# Altium schematic sheet Li-Ion boost.SchDoc
size A
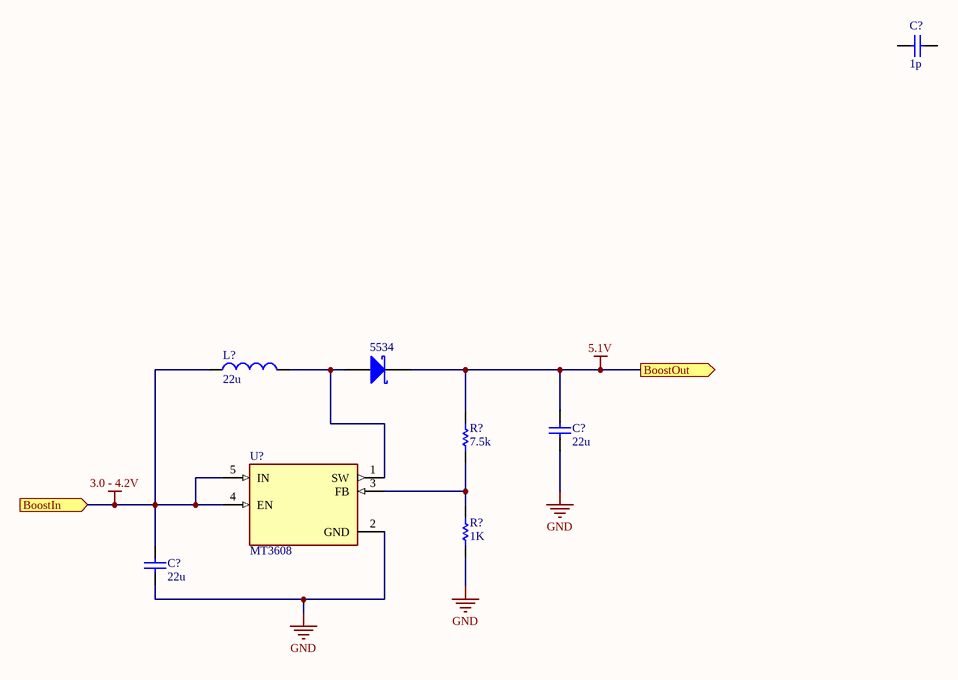
[diagram p0: Li-Ion boost.SchDoc]

## Parts
(Parts that share a designator on the sheet are numbered #1, #2 ... from top to bottom, then left to right.)
5534  Shottky Diode  (value not drawn)
C?#1  value 1p  (hidden comment: Capacitor)
C?#2  value 22u  (hidden comment: Capacitor)
C?#3  value 22u  (hidden comment: Capacitor)
L?  value 22u  (hidden comment: Inductor)
R?#1  value 7.5k  (hidden comment: Resistor)
R?#2  value 1K  (hidden comment: Resistor)
U?  MT3608  [SOT95P280X145-6N]

## Ports
BoostIn (in), BoostOut (out)

## Nets
3.0 - 4.2V: C?#3.2 L?.1 U?.4(EN) U?.5(IN) ; port BoostIn
5.1V: 5534.2(K) C?#2.2 R?#1.2 ; port BoostOut
GND: C?#2.1 C?#3.1 R?#2.1 U?.2(GND)
Net5534_1: 5534.1(A) L?.2 U?.1(SW)
NetR?#1_1: R?#1.1 R?#2.2 U?.3(FB)

Not connected (* = marked no-connect by the designer): C?#1 1 2

## Library data of the parts
5534 = Shottky Diode: AF: 1; BV: 0; BV_MAX: 1e99; EG: 1.11; FC: 0.5; IBV: 0.001; IS: 1e-14; MJSW: 0.33; NTUN: 30; TNOM: 27; XTI: 3; SimulationGenericComponent: True; CJO: 0; CJP: 0; CTA: 0; CTP: 0; FCS: 0.5; FV_MAX: 1e99; IKF: 0; IKR: 0; ISR: 1e-14; JSW: 0; JTUN: 0; JTUNSW: 0; KEG: 1; KF: 0; LEVEL: 1; N: 1; NBV: 1; NR: 1; NS: 1; PHP: 1; RS: 0; TCV: 0; TLEV: 0; TLEVC: 0; TM1: 0; TM2: 0; TPB: 0; TPHP: 0; TRS: 0; TRS2: 0; TT: 0; TTT1: 0; TTT2: 0; VJ: 1; XTITUN: 3
C?#1-C?#3 = Capacitor: SimulationGenericComponent: True
L? = Inductor: SimulationGenericComponent: True
R?#1 R?#2 = Resistor: TC1: 0; SimulationGenericComponent: True; TC2: 0
U? = MT3608: High Efficiency 1.2MHz2A Step Up Converter; MF: Aerosemi Technology Co., Ltd; Price: None; Availability: Not in stock; Package: Package; MP: MT3608; Value: *; SnapEDA_Link: https://www.snapeda.com/parts/MT3608/Aerosemi+Technology+Co.%252C+Ltd/view-part/?ref=snap; Check_prices: https://www.snapeda.com/parts/MT3608/Aerosemi+Technology+Co.%252C+Ltd/view-part/?ref=eda